# Altium schematic sheet power copy.SchDoc
size 260 x 185 mm
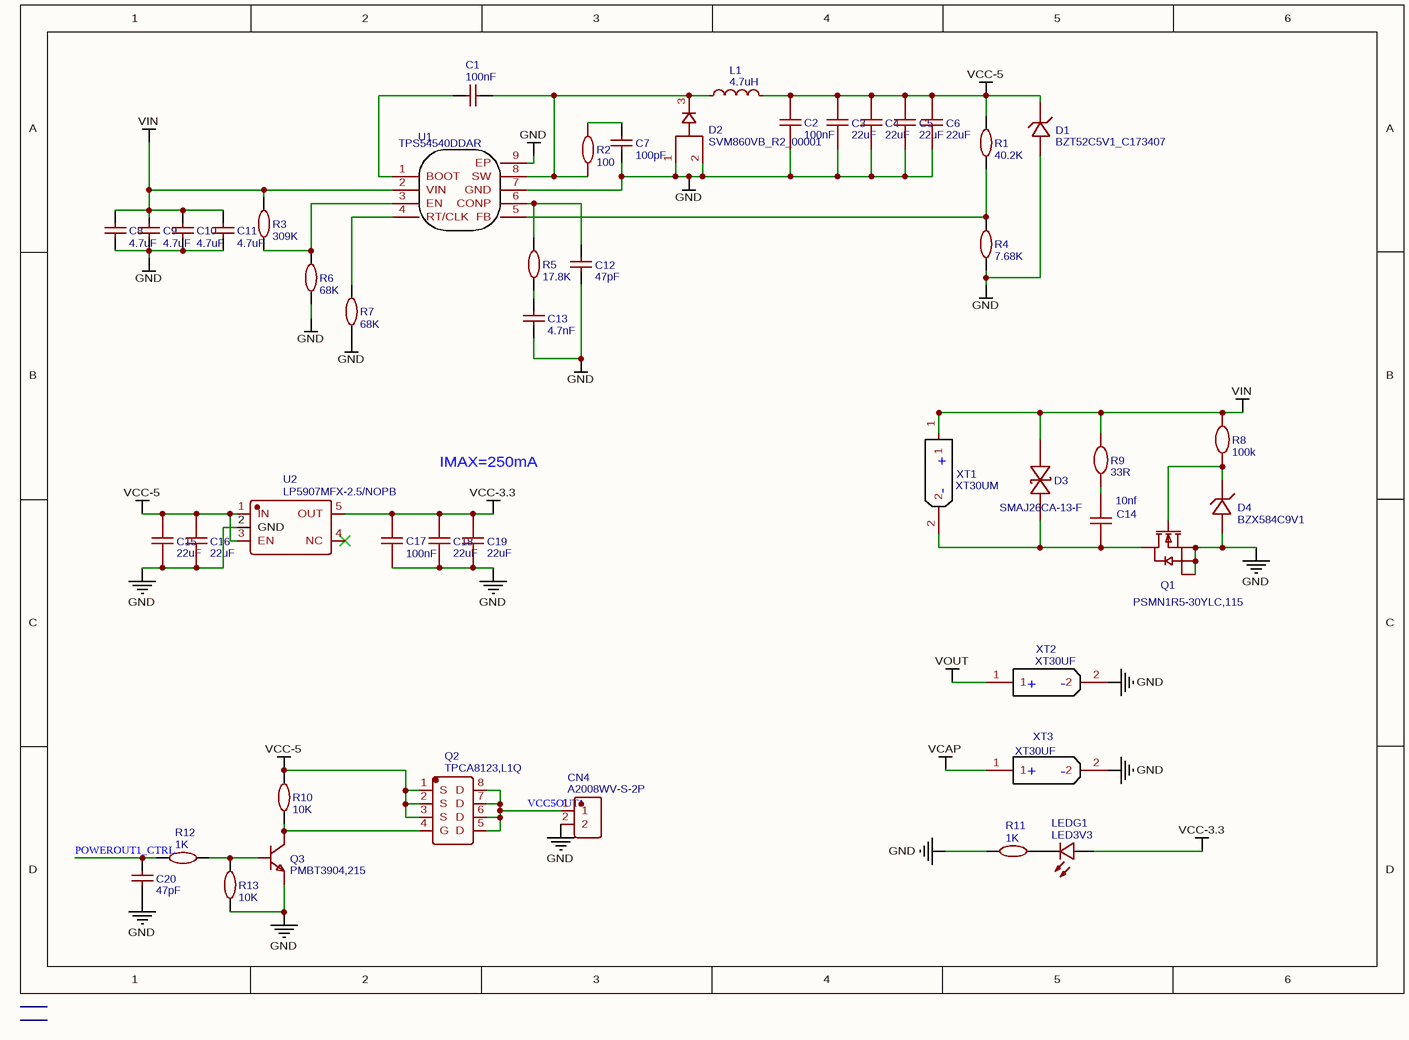
[diagram p0: power copy.SchDoc]

## Parts
C1  100nF  [C0603]
C2  100nF  [C0603]
C3  22uF  [C0603]
C4  22uF  [C0603]
C5  22uF  [C0603]
C6  22uF  [C0603]
C7  100pF  [C0603]
C8  4.7uF  [C0805]
C9  4.7uF  [C0805]
C10  4.7uF  [C0805]
C11  4.7uF  [C0805]
C12  47pF  [C0402]
C13  4.7nF  [C0402]
C14  10nf  [C0603]
C15  22uF  [C0603]
C16  22uF  [C0603]
C17  100nF  [C0402]
C18  22uF  [C0603]
C19  22uF  [C0603]
C20  47pF  [C0402]
CN4  A2008WV-S-2P  [CONN-SMD_A2008WV-S-2P]
D1  BZT52C5V1_C173407  [SOD-123_L2.7-W1.6-LS3.7-RD]
D2  SVM860VB_R2_00001  [TO-277B_3P-L6.1-W4.3-LS7.0-BR]
D3  SMAJ26CA-13-F  [SMA_L4.4-W2.6-LS5.0-BI]
D4  BZX584C9V1  [SOD-523F_L1.7-W0.9-LS1.7-RD]
L1  4.7uH  [IND-SMD_L6.0-W6.0]
LEDG1  LED3V3  [LED-0603]
Q1  PSMN1R5-30YLC,115  [SOT-669_L4.9-W4.0-P1.27-LS6.0-BR]
Q2  TPCA8123,L1Q  [POWERVDFN-8_L6.0-W5.0-P1.27-BL]
Q3  PMBT3904,215  [SOT-23_L2.9-W1.3-P0.95-LS2.4-BR]
R1  40.2K  [R0603]
R2  100  [R0402]
R3  309K  [R0603]
R4  7.68K  [R0402]
R5  17.8K  [R0603]
R6  68K  [R0603]
R7  68K  [R0603]
R8  100k  [R0603]
R9  33R  [R0603]
R10  10K  [R0402]
R11  1K  [R0603]
R12  1K  [R0402]
R13  10K  [R0402]
U1  TPS54540DDAR  [SOIC-8_L4.9-W3.9-P1.27-LS6.0-BL-EP]
U2  LP5907MFX-2.5/NOPB  [SOT-23-5_L3.0-W1.7-P0.95-LS2.8-BL]
XT1  XT30UM  [CONN-TH_XT30UPB-F]
XT2  XT30UF  [CONN-TH_XT30UPB-F]
XT3  XT30UF  [CONN-TH_XT30UPB-F]

## Nets
GND: C2.1 C3.1 C4.1 C5.1 C6.1 C7.2 C8.1 C9.1 C10.1 C11.1 C12.1 C13.1 C15.1 C16.1 C17.1 C18.1 C19.1 C20.1 CN4.2 D1.2(A) D2.1 D2.2 D4.2(A) Q1.1(S) Q1.2(S) Q1.3(S) Q3.2 R4.1 R6.1 R7.1 R11.1 R13.1 U1.7(GND) U1.9(EP) U2.2(GND) XT2.2 XT3.2
VCAP: XT3.1
VCC-3.3: C17.2 C18.2 C19.2 LEDG1.1(A) U2.5(OUT)
VCC-5: C2.2 C3.2 C4.2 C5.2 C6.2 C15.2 C16.2 D1.1(C) L1.2 Q2.1(S) Q2.2(S) Q2.3(S) R1.2 R10.2 U2.1(IN) U2.3(EN)
VIN: C8.2 C9.2 C10.2 C11.2 D3.2 R3.2 R8.2 R9.2 U1.2(VIN) XT1.1
VOUT: XT2.1
POWEROUT1_CTRL: C20.2 R12.1
VCC5OUT1: CN4.1 Q2.5(D) Q2.6(D) Q2.7(D) Q2.8(D)
NetC1_1: C1.1 U1.1(BOOT)
NetC1_2: C1.2 D2.3 L1.1 R2.1 U1.8(SW)
NetC7_1: C7.1 R2.2
NetC12_2: C12.2 R5.2 U1.6(CONP)
NetC13_2: C13.2 R5.1
NetC14_1: C14.1 D3.1 Q1.5(D) XT1.2
NetC14_2: C14.2 R9.1
NetD4_1: D4.1(K) Q1.4(G) R8.1
NetLEDG1_2: LEDG1.2(C) R11.2
NetQ2_4: Q2.4(G) Q3.3 R10.1
NetQ3_1: Q3.1 R12.2 R13.2
NetR1_1: R1.1 R4.2 U1.5(FB)
NetR3_1: R3.1 R6.2 U1.3(EN)
NetR7_2: R7.2 U1.4(RT/CLK)

Not connected (* = marked no-connect by the designer): U2 4(NC)*

## Notes on the sheet
- IMAX=250mA
- (in symbol XT30UF) +; -
- (in symbol XT30UM) +; -

## Library data of the parts
C1 = 100nF: BOM_Manufacturer Part: CL05B104KO5NNNC; BOM_Manufacturer: SAMSUNG; nameAlias: Capacitance; BOM_Supplier: LCSC; BOM_LCSC Assembly: Yes; BOM_Supplier Part: C1525; spicePre: C; spiceSymbolName: CL05B104KO5NNNC
C2 = 100nF: BOM_Manufacturer: YAGEO; BOM_Manufacturer Part: AC0603KRX7R0BB104; nameAlias: Capacitance; Contributor: LCSC; BOM_Supplier: LCSC; BOM_Supplier Part: C408909; spicePre: C; spiceSymbolName: AC0603KRX7R0BB104
C3-C6 C15 C16 C18 C19 = 22uF: BOM_Manufacturer: SAMSUNG; BOM_Manufacturer Part: CL10A226MQ8NRNC; nameAlias: Capacitance; SMT Type: Basic; BOM_Supplier: LCSC; BOM_LCSC Assembly: Yes; BOM_Supplier Part: C59461; spicePre: C; spiceSymbolName: CL10A226MQ8NRNC
C7 = 100pF: BOM_Manufacturer Part: CGA3E2C0G1H101JT0Y0N; BOM_Manufacturer: TDK; nameAlias: Capacitance; BOM_Supplier: LCSC; BOM_Supplier Part: C76709; spicePre: C; spiceSymbolName: CGA3E2C0G1H101JT0Y0N
C8-C11 = 4.7uF: BOM_Manufacturer: SAMSUNG; BOM_Manufacturer Part: CL21A475KBQNNNE; nameAlias: Capacitance; BOM_Supplier: LCSC; BOM_Supplier Part: C98192; spicePre: C; spiceSymbolName: CL21A475KBQNNNE
C12 C20 = 47pF: BOM_Manufacturer: FH; BOM_Manufacturer Part: 0402CG470J500NT; nameAlias: Capacitance; SMT Type: Basic; BOM_Supplier: LCSC; BOM_LCSC Assembly: Yes; BOM_Supplier Part: C1567; spicePre: C; spiceSymbolName: 0402CG470J500NT
C13 = 4.7nF: BOM_Manufacturer: FH; BOM_Manufacturer Part: 0402B472K500NT; nameAlias: Capacitance; SMT Type: Basic; BOM_Supplier: LCSC; BOM_LCSC Assembly: Yes; BOM_Supplier Part: C1538; spicePre: C; spiceSymbolName: 0402B472K500NT
C14 = 10nf: nameAlias: Value(F); spicePre: C; spiceSymbolName: Cap_0402_US
C17 = 100nF: BOM_Manufacturer: MuRata; BOM_Manufacturer Part: GRM188R71H104KA93D; nameAlias: Capacitance; BOM_Supplier: LCSC; BOM_Supplier Part: C77055; spicePre: C; spiceSymbolName: GRM188R71H104KA93D
CN4 = A2008WV-S-2P: BOM_Manufacturer: Changjiang Connectors; Contributor: LCSC; BOM_Supplier: LCSC; BOM_Supplier Part: C273123; BOM_Manufacturer Part: A2008WV-S-2P; spicePre: C; spiceSymbolName: A2008WV-S-2P
D1 = BZT52C5V1_C173407: BOM_Manufacturer: (MDD) Jiangsu Yutai Elec; Contributor: LCSC; SMT Type: Extend; BOM_Supplier: LCSC; BOM_Supplier Part: C173407; BOM_Manufacturer Part: BZT52C5V1; BOM_LCSC Assembly: Yes; spicePre: D; spiceSymbolName: BZT52C5V1_C173407
D2 = SVM860VB_R2_00001: BOM_Manufacturer: PANJIT International; Contributor: LCSC; BOM_Supplier: LCSC; BOM_Supplier Part: C391734; BOM_Manufacturer Part: SVM860VB_R2_00001; spicePre: D; spiceSymbolName: SVM860VB_R2_00001
D3 = SMAJ26CA-13-F: BOM_Manufacturer: DIODES; Contributor: LCSC; SMT Type: Extend; BOM_Supplier: LCSC; BOM_Manufacturer Part: SMAJ26CA-13-F; BOM_Supplier Part: C134976; BOM_LCSC Assembly: Yes; spicePre: D; spiceSymbolName: SMAJ26CA-13-F
D4 = BZX584C9V1: SMT Type: Extend; BOM_Supplier: LCSC; BOM_LCSC Assembly: Yes; spicePre: D; spiceSymbolName: BZX584C12-V-G-08
L1 = 4.7uH: BOM_Manufacturer: ShunXiang Connaught Elec; BOM_Manufacturer Part: SMNR6028-4R7MT; nameAlias: Inductance; Contributor: LCSC; BOM_Supplier: LCSC; BOM_Supplier Part: C266428; spicePre: L; spiceSymbolName: SMNR6028-4R7MT
LEDG1 = LED3V3: BOM_Manufacturer: EVERLIGHT; BOM_Manufacturer Part: 19-217/GHC-YR1S2/3T; BOM_Supplier: LCSC; BOM_LCSC Assembly: Yes; image: //image.lceda.cn/szlcsc/C72043.jpg; BOM_Supplier Part: C72043; spicePre: L
Q1 = PSMN1R5-30YLC,115: BOM_Manufacturer: Nexperia; Contributor: LCSC; BOM_Supplier: LCSC; BOM_Supplier Part: C427523; BOM_Manufacturer Part: PSMN1R5-30YLC,115; spicePre: Q; spiceSymbolName: PSMN1R5-30YLC,115
Q2 = TPCA8123,L1Q: BOM_Manufacturer: TOSHIBA; Contributor: LCSC; SMT Type: Extend; BOM_Supplier: LCSC; BOM_Supplier Part: C180399; BOM_Manufacturer Part: TPCA8123,L1Q; BOM_LCSC Assembly: Yes; spicePre: Q; spiceSymbolName: TPCA8123,L1Q
Q3 = PMBT3904,215: BOM_Manufacturer: Nexperia; SMT Type: Extend; BOM_Supplier: LCSC; BOM_Manufacturer Part: PMBT3904,215; image: //image.lceda.cn/szlcsc/C8667.jpg; BOM_Supplier Part: C8667; BOM_LCSC Assembly: Yes; spicePre: Q; spiceSymbolName: PMBT3904,215
R1 = 40.2K: BOM_Manufacturer: UniOhm; BOM_Manufacturer Part: 0603WAF4022T5E; nameAlias: Resistance (Ohms); SMT Type: Basic; BOM_Supplier: LCSC; BOM_LCSC Assembly: Yes; BOM_Supplier Part: C12447; spicePre: R; spiceSymbolName: 0603WAF4022T5E
R2 = 100: BOM_Manufacturer: YAGEO; BOM_Manufacturer Part: AC0402FR-07100RL; nameAlias: Resistance (Ohms); Contributor: LCSC; BOM_Supplier: LCSC; BOM_Supplier Part: C144808; spicePre: R; spiceSymbolName: AC0402FR-07100RL
R3 = 309K: BOM_Manufacturer: UniOhm; BOM_Manufacturer Part: 0603WAF3093T5E; nameAlias: Resistance (Ohms); SMT Type: Extend; BOM_Supplier: LCSC; BOM_Supplier Part: C23001; BOM_LCSC Assembly: Yes; spicePre: R; spiceSymbolName: 0603WAF3093T5E
R4 = 7.68K: BOM_Manufacturer: UniOhm; BOM_Manufacturer Part: 0402WGF7681TCE; nameAlias: Resistance (Ohms); SMT Type: Extend; BOM_Supplier: LCSC; BOM_Supplier Part: C25919; BOM_LCSC Assembly: Yes; spicePre: R; spiceSymbolName: 0402WGF7681TCE
R5 = 17.8K: BOM_Manufacturer: UniOhm; BOM_Manufacturer Part: 0603WAF1782T5E; nameAlias: Resistance (Ohms); SMT Type: Extend; BOM_Supplier: LCSC; BOM_Supplier Part: C22821; BOM_LCSC Assembly: Yes; spicePre: R; spiceSymbolName: 0603WAF1782T5E
R6 R7 = 68K: BOM_Manufacturer: UniOhm; BOM_Manufacturer Part: 0603WAF6802T5E; nameAlias: Resistance (Ohms); SMT Type: Basic; BOM_Supplier: LCSC; BOM_LCSC Assembly: Yes; BOM_Supplier Part: C23231; spicePre: R; spiceSymbolName: 0603WAF6802T5E
R8 = 100k: nameAlias: Value(Ω); spicePre: R; spiceSymbolName: Res_AXIAL-0.3(1/8W)_EU
R9 = 33R: nameAlias: Value(Ω); spicePre: R; spiceSymbolName: Res_AXIAL-0.3(1/8W)_EU
R10 R13 = 10K: BOM_Manufacturer: UniOhm; BOM_Manufacturer Part: 0402WGF1002TCE; nameAlias: Resistance (Ohms); SMT Type: Basic; BOM_Supplier: LCSC; BOM_LCSC Assembly: Yes; BOM_Supplier Part: C25744; spicePre: R; spiceSymbolName: 0402WGF1002TCE
R11 R12 = 1K: BOM_Manufacturer: UniOhm; BOM_Manufacturer Part: 0402WGF1001TCE; nameAlias: Resistance (Ohms); SMT Type: Basic; BOM_Supplier: LCSC; BOM_LCSC Assembly: Yes; BOM_Supplier Part: C11702; spicePre: R; spiceSymbolName: 0402WGF1001TCE
U1 = TPS54540DDAR: BOM_Manufacturer: TI; SMT Type: Extend; BOM_Supplier: LCSC; BOM_Manufacturer Part: TPS54540DDAR; BOM_Supplier Part: C95286; BOM_LCSC Assembly: Yes; spicePre: U; spiceSymbolName: TPS54540DDAR
U2 = LP5907MFX-2.5/NOPB: BOM_Manufacturer: TI; Contributor: LCSC; SMT Type: Extend; BOM_Supplier: LCSC; BOM_Manufacturer Part: LP5907MFX-2.5/NOPB; BOM_Supplier Part: C165132; BOM_LCSC Assembly: Yes; spicePre: U; spiceSymbolName: LP5907MFX-2.5/NOPB
XT1 = XT30UM: BOM_Manufacturer Part: XT60; Contributor: 4bucks; Package Display: No; spicePre: X
XT2 XT3 = XT30UF: BOM_Manufacturer Part: XT60; Contributor: 4bucks; Package Display: No; spicePre: X